# EAGLE schematic Rev_must_do_it,,,,,,,,,,, (EAGLE 9.3.0)

## Sheet 1 of 4
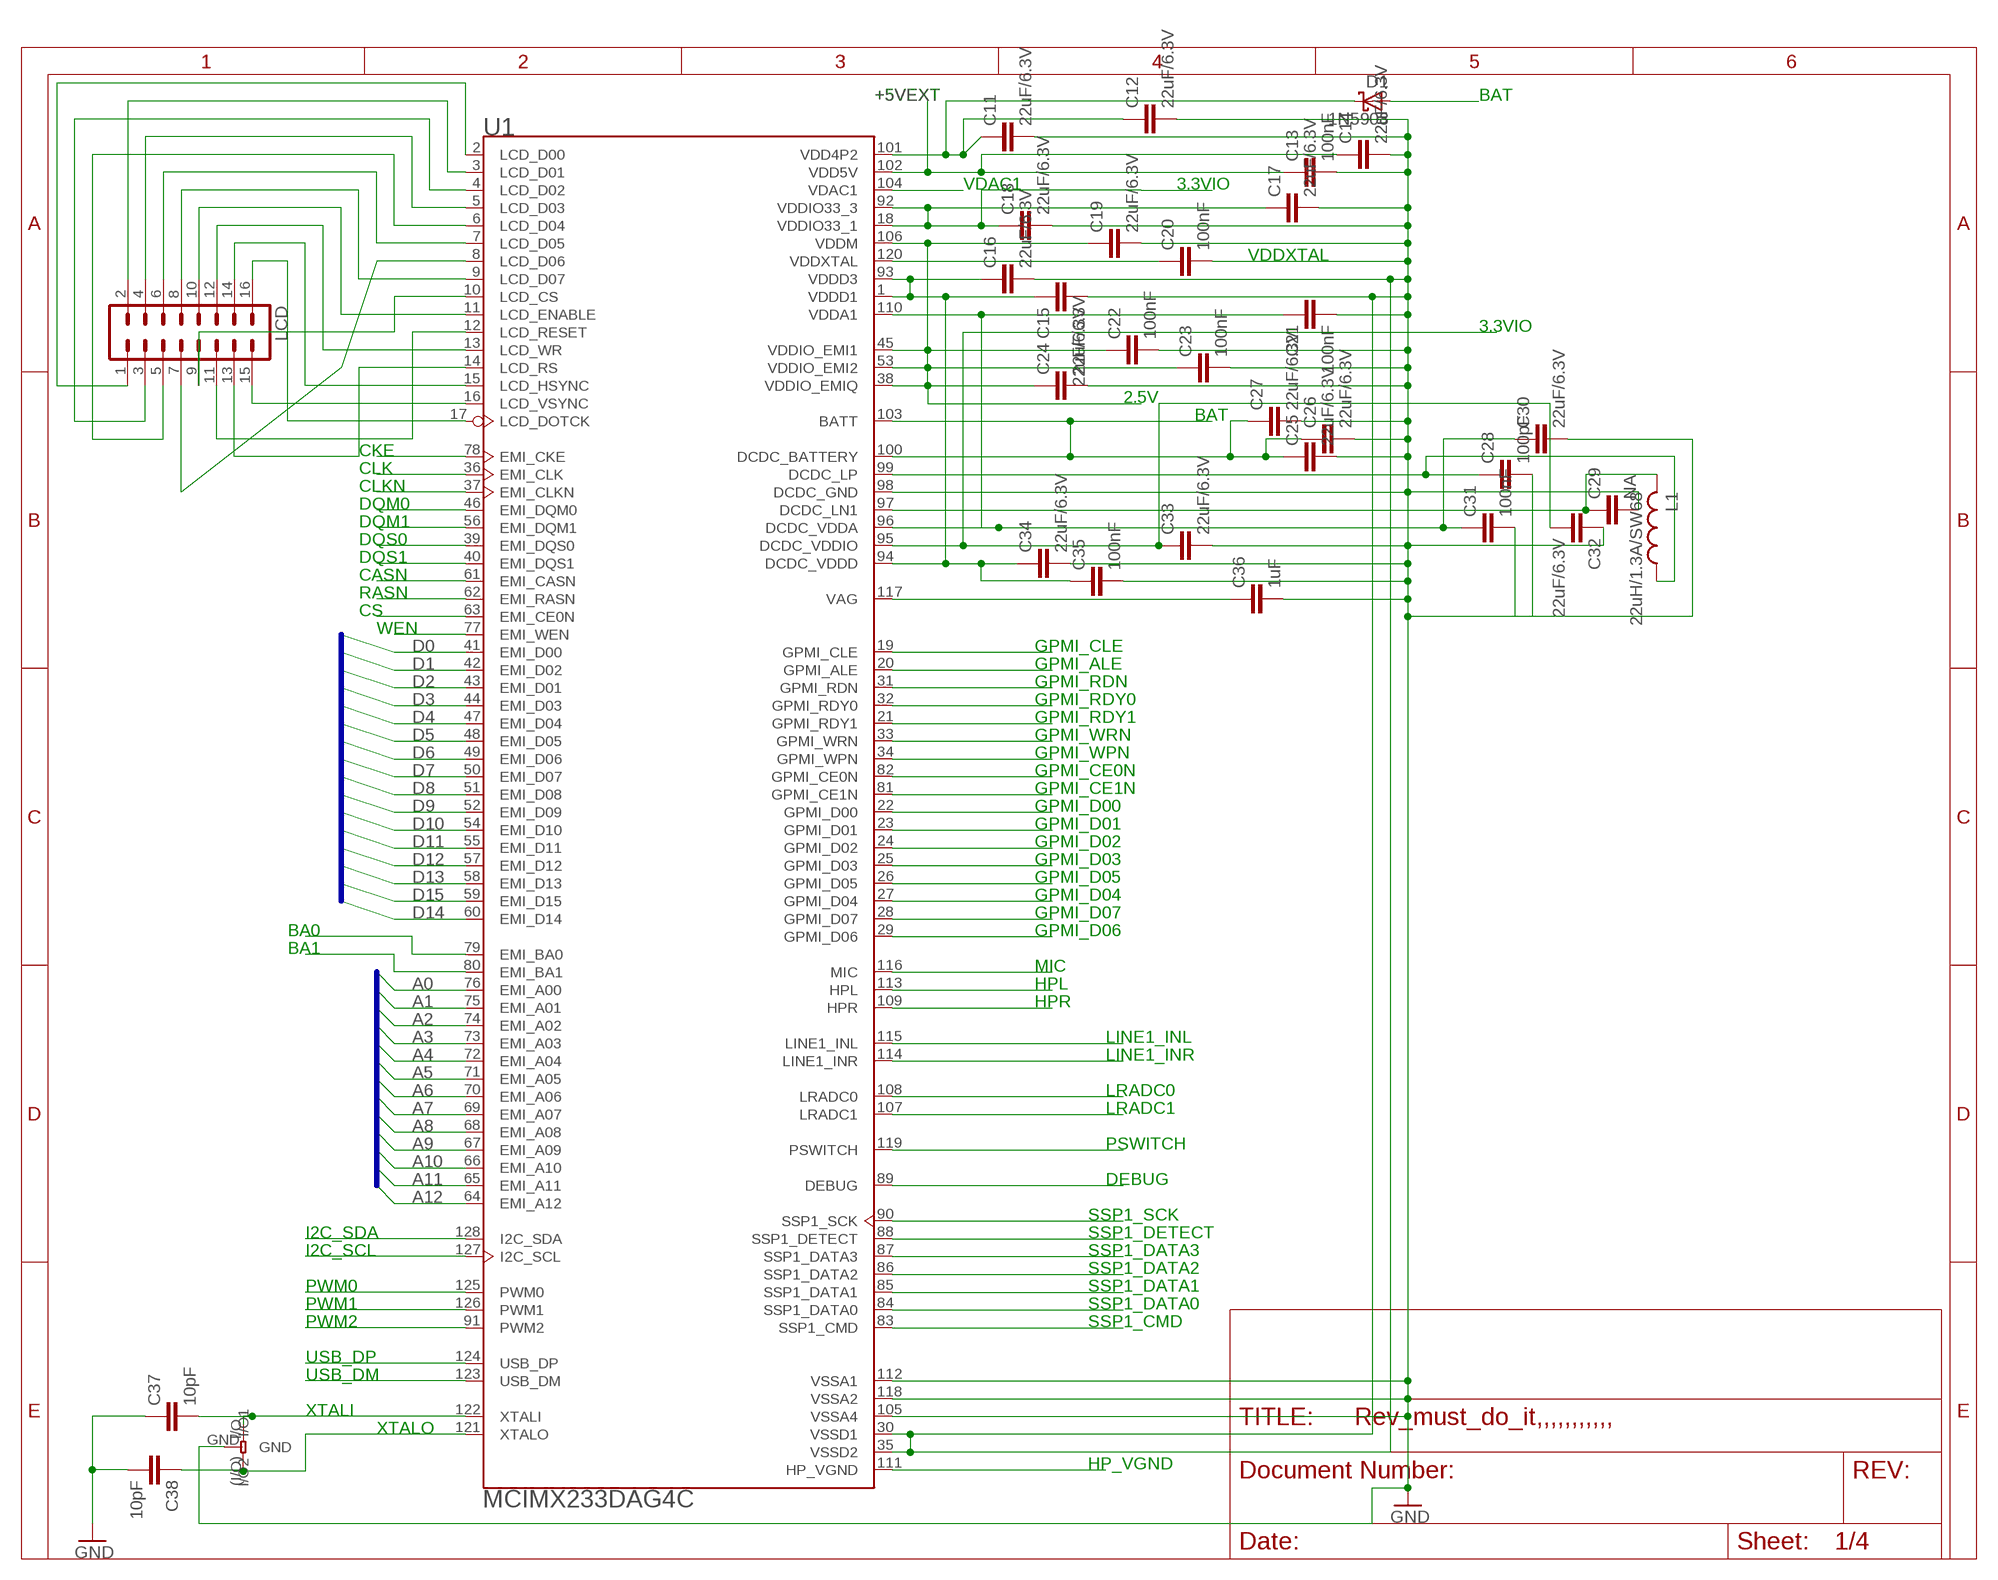
[diagram p0: schematic, sheet 1]

### Parts
C11  22uF/6.3V  C-EUC1206  [C1206]
C12  22uF/6.3V  C-EUC1206  [C1206]
C13  100nF  C-EUC1206  [C1206]
C14  22uF/6.3V  C-EUC1206  [C1206]
C15  22uF/6.3V  C-EUC1206  [C1206]
C16  22uF/6.3V  C-EUC1206  [C1206]
C17  22uF/6.3V  C-EUC1206  [C1206]
C18  22uF/6.3V  C-EUC1206  [C1206]
C19  22uF/6.3V  C-EUC1206  [C1206]
C20  100nF  C-EUC1206  [C1206]
C21  100nF  C-EUC1206  [C1206]
C22  100nF  C-EUC1206  [C1206]
C23  100nF  C-EUC1206  [C1206]
C24  22uF/6.3V  C-EUC1206  [C1206]
C25  22uF/6.3V  C-EUC1206  [C1206]
C26  22uF/6.3V  C-EUC1206  [C1206]
C27  22uF/6.3V  C-EUC1206  [C1206]
C28  100pF  C-EUC1206  [C1206]
C29  NA  C-EUC1206  [C1206]
C30  22uF/6.3V  C-EUC1206  [C1206]
C31  100nF  C-EUC1206  [C1206]
C32  22uF/6.3V  C-EUC1206  [C1206]
C33  22uF/6.3V  C-EUC1206  [C1206]
C34  22uF/6.3V  C-EUC1206  [C1206]
C35  100nF  C-EUC1206  [C1206]
C36  1uF  C-EUC1206  [C1206]
C37  10pF  C-EUC1206  [C1206]
C38  10pF  C-EUC1206  [C1206]
D1  1N5908  [C4111-15]
L1  22uH/1.3A/SW68  L-USLAL02  [LAL02]
LCD  MA08-2  [MA08-2]
U1  MCIMX233DAG4C  [QFP40P1600X1600X160-128N]
U$2  CRYSTAL  [CRYSTAL]

### Nets
2.5V: C19.1 C22.1 C23.1 C24.1 U1.38(VDDIO_EMIQ) U1.45(VDDIO_EMI1) U1.53(VDDIO_EMI2) U1.106(VDDM) ; also sheet 2,3
3.3VIO: C17.1 C18.1 C32.2 C33.1 U1.18(VDDIO33_1) U1.92(VDDIO33_3) U1.95(DCDC_VDDIO) ; also sheet 4
+5VEXT: C13.1 C14.1 U1.102(VDD5V) ; also sheet 3,4
A0: U1.76(EMI_A00) ; also sheet 2
A1: U1.75(EMI_A01) ; also sheet 2
A2: U1.74(EMI_A02) ; also sheet 2
A3: U1.73(EMI_A03) ; also sheet 2
A4: U1.72(EMI_A04) ; also sheet 2
A5: U1.71(EMI_A05) ; also sheet 2
A6: U1.70(EMI_A06) ; also sheet 2
A7: U1.69(EMI_A07) ; also sheet 2
A8: U1.68(EMI_A08) ; also sheet 2
A9: U1.67(EMI_A09) ; also sheet 2
A10: U1.66(EMI_A10) ; also sheet 2
A11: U1.65(EMI_A11) ; also sheet 2
A12: U1.64(EMI_A12) ; also sheet 2
BA0: U1.79(EMI_BA0) ; also sheet 2
BA1: U1.80(EMI_BA1) ; also sheet 2
BAT: C25.1 C26.1 C27.1 D1.A U1.100(DCDC_BATTERY) U1.103(BATT)
CASN: U1.61(EMI_CASN) ; also sheet 2
CKE: U1.78(EMI_CKE) ; also sheet 2
CLK: U1.36(EMI_CLK) ; also sheet 2
CLKN: U1.37(EMI_CLKN) ; also sheet 2
CS: U1.63(EMI_CE0N) ; also sheet 2
D0: U1.41(EMI_D00) ; also sheet 2
D1: U1.42(EMI_D02) ; also sheet 2
D2: U1.43(EMI_D01) ; also sheet 2
D3: U1.44(EMI_D03) ; also sheet 2
D4: U1.47(EMI_D04) ; also sheet 2
D5: U1.48(EMI_D05) ; also sheet 2
D6: U1.49(EMI_D06) ; also sheet 2
D7: U1.50(EMI_D07) ; also sheet 2
D8: U1.51(EMI_D08) ; also sheet 2
D9: U1.52(EMI_D09) ; also sheet 2
D10: U1.54(EMI_D10) ; also sheet 2
D11: U1.55(EMI_D11) ; also sheet 2
D12: U1.57(EMI_D12) ; also sheet 2
D13: U1.58(EMI_D13) ; also sheet 2
D14: U1.60(EMI_D14) ; also sheet 2
D15: U1.59(EMI_D15) ; also sheet 2
DCDC_VDDA1: C21.1 C30.1 C31.1 U1.96(DCDC_VDDA) U1.110(VDDA1)
DCDC_VDDD: C15.1 C16.1 C34.1 C35.1 U1.1(VDDD1) U1.93(VDDD3) U1.94(DCDC_VDDD)
DEBUG: U1.89(DEBUG) ; also sheet 3
DQM0: U1.46(EMI_DQM0) ; also sheet 2
DQM1: U1.56(EMI_DQM1) ; also sheet 2
DQS0: U1.39(EMI_DQS0) ; also sheet 2
DQS1: U1.40(EMI_DQS1) ; also sheet 2
GND: C11.2 C12.2 C13.2 C14.2 C15.2 C16.2 C17.2 C18.2 C19.2 C20.2 C21.2 C22.2 C23.2 C24.2 C25.2 C26.2 C27.2 C28.2 C29.2 C30.2 C31.2 C32.1 C33.2 C34.2 C35.2 C36.2 C37.1 C38.2 U1.30(VSSD1) U1.35(VSSD2) U1.98(DCDC_GND) U1.105(VSSA4) U1.112(VSSA1) U1.118(VSSA2) U$2.GND ; also sheet 2,3,4
GPMI_ALE: U1.20(GPMI_ALE) ; also sheet 3
GPMI_CE0N: U1.82(GPMI_CE0N) ; also sheet 3
GPMI_CE1N: U1.81(GPMI_CE1N) ; also sheet 3
GPMI_CLE: U1.19(GPMI_CLE) ; also sheet 3
GPMI_D00: U1.22(GPMI_D00) ; also sheet 3
GPMI_D01: U1.23(GPMI_D01) ; also sheet 3
GPMI_D02: U1.24(GPMI_D02) ; also sheet 3
GPMI_D03: U1.25(GPMI_D03) ; also sheet 3
GPMI_D04: U1.27(GPMI_D04) ; also sheet 3
GPMI_D05: U1.26(GPMI_D05) ; also sheet 3
GPMI_D06: U1.29(GPMI_D06) ; also sheet 3
GPMI_D07: U1.28(GPMI_D07) ; also sheet 3
GPMI_RDN: U1.31(GPMI_RDN) ; also sheet 3
GPMI_RDY0: U1.32(GPMI_RDY0) ; also sheet 3
GPMI_RDY1: U1.21(GPMI_RDY1) ; also sheet 3
GPMI_WPN: U1.34(GPMI_WPN) ; also sheet 3
GPMI_WRN: U1.33(GPMI_WRN) ; also sheet 3
HP_VGND: U1.111(HP_VGND)
HPL: U1.113(HPL) ; also sheet 3
HPR: U1.109(HPR) ; also sheet 3
I2C_SCL: U1.127(I2C_SCL) ; also sheet 3
I2C_SDA: U1.128(I2C_SDA) ; also sheet 3
LINE1_INL: U1.115(LINE1_INL) ; also sheet 3
LINE1_INR: U1.114(LINE1_INR) ; also sheet 3
LRADC0: U1.108(LRADC0) ; also sheet 3
LRADC1: U1.107(LRADC1) ; also sheet 3
MIC: U1.116(MIC) ; also sheet 3
N$1: C36.1 U1.117(VAG)
N$6: C11.1 C12.1 D1.C U1.101(VDD4P2)
N$7: LCD.1 U1.2(LCD_D00)
N$10: C29.1 L1.2 U1.97(DCDC_LN1)
N$11: C28.1 L1.1 U1.99(DCDC_LP)
N$12: LCD.2 U1.3(LCD_D01)
N$13: LCD.3 U1.4(LCD_D02)
N$14: LCD.4 U1.5(LCD_D03)
N$15: LCD.5 U1.6(LCD_D04)
N$16: LCD.6 U1.7(LCD_D05)
N$17: LCD.7 U1.8(LCD_D06)
N$20: LCD.8 U1.9(LCD_D07)
N$21: LCD.9 U1.10(LCD_CS)
N$22: LCD.10 U1.11(LCD_ENABLE)
N$23: LCD.11 U1.12(LCD_RESET)
N$24: LCD.12 U1.13(LCD_WR)
N$25: LCD.13 U1.14(LCD_RS)
N$26: LCD.14 U1.15(LCD_HSYNC)
N$27: LCD.15 U1.16(LCD_VSYNC)
N$28: LCD.16 U1.17(LCD_DOTCK)
PSWITCH: U1.119(PSWITCH) ; also sheet 3,4
PWM0: U1.125(PWM0) ; also sheet 3
PWM1: U1.126(PWM1) ; also sheet 3
PWM2: U1.91(PWM2) ; also sheet 3
RASN: U1.62(EMI_RASN) ; also sheet 2
SSP1_CMD: U1.83(SSP1_CMD) ; also sheet 3,4
SSP1_DATA0: U1.84(SSP1_DATA0) ; also sheet 3,4
SSP1_DATA1: U1.85(SSP1_DATA1) ; also sheet 3,4
SSP1_DATA2: U1.86(SSP1_DATA2) ; also sheet 3
SSP1_DATA3: U1.87(SSP1_DATA3) ; also sheet 3,4
SSP1_DETECT: U1.88(SSP1_DETECT) ; also sheet 4
SSP1_SCK: U1.90(SSP1_SCK) ; also sheet 3,4
USB_DM: U1.123(USB_DM) ; also sheet 4
USB_DP: U1.124(USB_DP) ; also sheet 4
VDAC1: U1.104(VDAC1)
VDDXTAL: C20.1 U1.120(VDDXTAL) ; also sheet 4
WEN: U1.77(EMI_WEN) ; also sheet 2
XTALI: C37.2 U1.122(XTALI) U$2.I/O(I/O2) ; also sheet 4
XTALO: C38.1 U1.121(XTALO) U$2.(I/O)(I/O1) ; also sheet 4

### Buses
ADDR:A[0..12]
DATA:D[0..15]

## Sheet 2 of 4
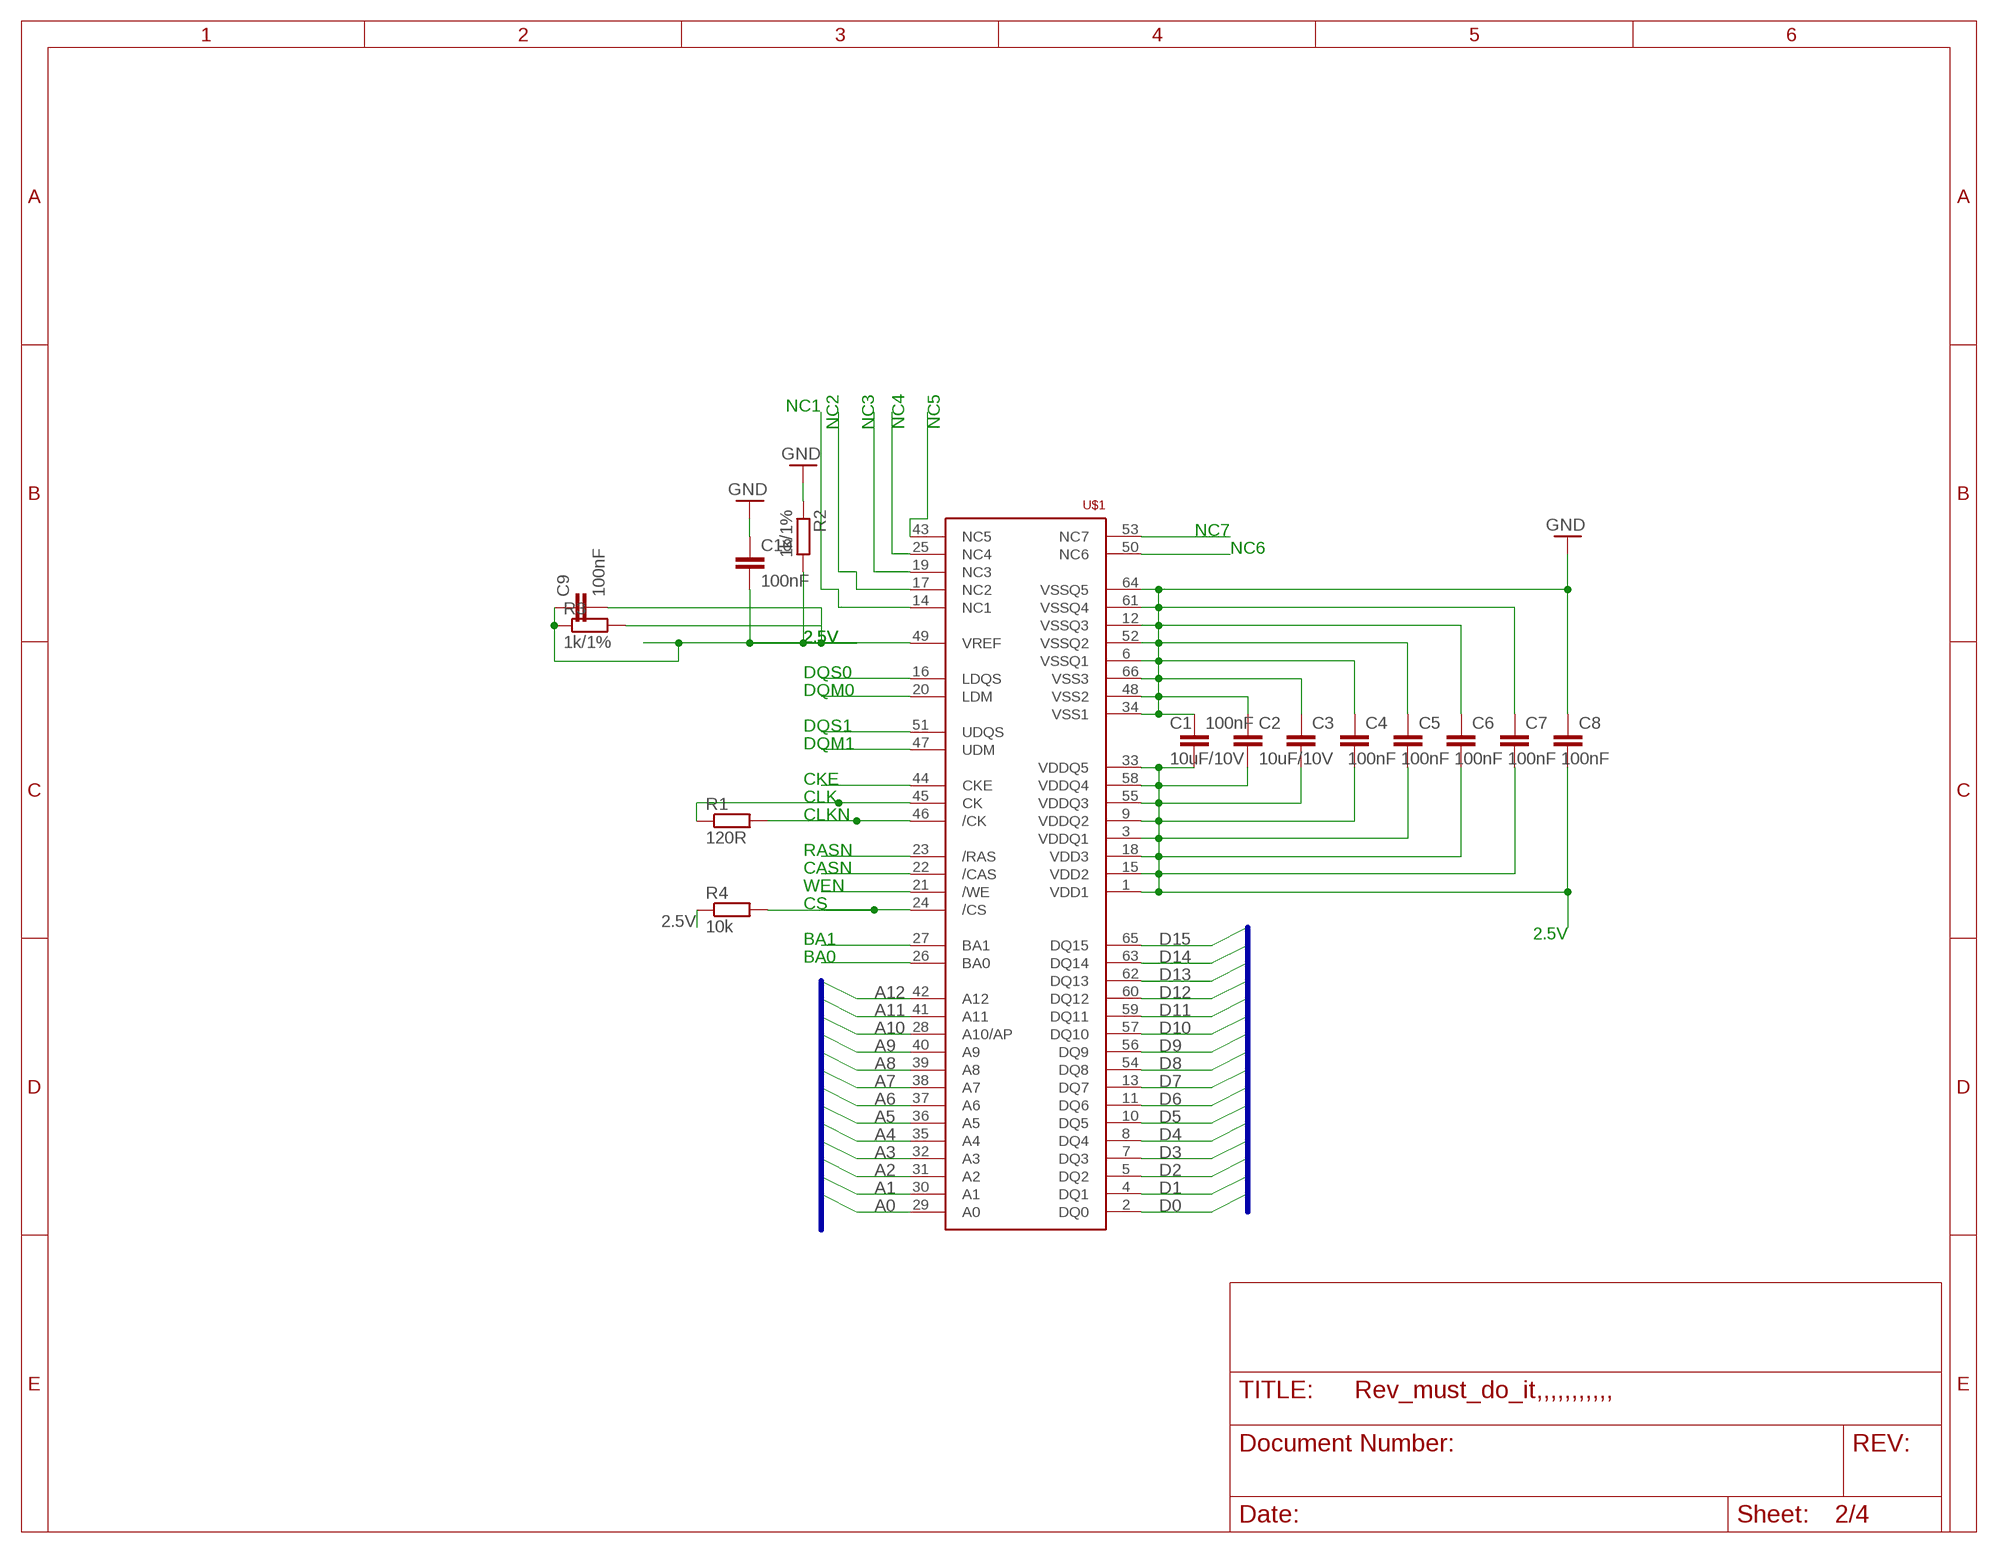
[diagram p1: schematic, sheet 2]

### Parts
C1  10uF/10V  C-EUC1206  [C1206]
C2  100nF  C-EUC1206  [C1206]
C3  10uF/10V  C-EUC1206  [C1206]
C4  100nF  C-EUC1206  [C1206]
C5  100nF  C-EUC1206  [C1206]
C6  100nF  C-EUC1206  [C1206]
C7  100nF  C-EUC1206  [C1206]
C8  100nF  C-EUC1206  [C1206]
C9  100nF  C-EUC1206  [C1206]
C10  100nF  C-EUC1206  [C1206]
R1  120R  R-EU_R1206  [R1206]
R2  1k/1%  R-EU_R1206  [R1206]
R3  1k/1%  R-EU_R1206  [R1206]
R4  10k  R-EU_R1206  [R1206]
U$1  HY5DU121622D(L)T(P)-JTSOP-II  [TSOP66]

### Nets
2.5V: C1.2 C2.2 C3.2 C4.2 C5.2 C6.2 C7.2 C8.2 C9.1 C9.2 C10.2 R2.2 R3.1 R4.1 U$1.1(VDD1) U$1.3(VDDQ1) U$1.9(VDDQ2) U$1.15(VDD2) U$1.18(VDD3) U$1.33(VDDQ5) U$1.49(VREF) U$1.55(VDDQ3) U$1.58(VDDQ4) ; also sheet 1,3
A0: U$1.29(A0) ; also sheet 1
A1: U$1.30(A1) ; also sheet 1
A2: U$1.31(A2) ; also sheet 1
A3: U$1.32(A3) ; also sheet 1
A4: U$1.35(A4) ; also sheet 1
A5: U$1.36(A5) ; also sheet 1
A6: U$1.37(A6) ; also sheet 1
A7: U$1.38(A7) ; also sheet 1
A8: U$1.39(A8) ; also sheet 1
A9: U$1.40(A9) U$1.63(DQ14) ; also sheet 1
A10: U$1.28(A10/AP) ; also sheet 1
A11: U$1.41(A11) ; also sheet 1
A12: U$1.42(A12) ; also sheet 1
BA0: U$1.26(BA0) ; also sheet 1
BA1: U$1.27(BA1) ; also sheet 1
CASN: U$1.22(/CAS) ; also sheet 1
CKE: U$1.44(CKE) ; also sheet 1
CLK: R1.1 U$1.45(CK) ; also sheet 1
CLKN: R1.2 U$1.46(/CK) ; also sheet 1
CS: R4.2 U$1.24(/CS) ; also sheet 1
D0: U$1.2(DQ0) ; also sheet 1
D1: U$1.4(DQ1) ; also sheet 1
D2: U$1.5(DQ2) ; also sheet 1
D3: U$1.7(DQ3) ; also sheet 1
D4: U$1.8(DQ4) ; also sheet 1
D5: U$1.10(DQ5) ; also sheet 1
D6: U$1.11(DQ6) ; also sheet 1
D7: U$1.13(DQ7) ; also sheet 1
D8: U$1.54(DQ8) ; also sheet 1
D9: U$1.56(DQ9) ; also sheet 1
D10: U$1.57(DQ10) ; also sheet 1
D11: U$1.59(DQ11) ; also sheet 1
D12: U$1.60(DQ12) ; also sheet 1
D13: U$1.62(DQ13) ; also sheet 1
D15: U$1.65(DQ15) ; also sheet 1
DQM0: U$1.20(LDM) ; also sheet 1
DQM1: U$1.47(UDM) ; also sheet 1
DQS0: U$1.16(LDQS) ; also sheet 1
DQS1: U$1.51(UDQS) ; also sheet 1
GND: C1.1 C2.1 C3.1 C4.1 C5.1 C6.1 C7.1 C8.1 C10.1 R2.1 U$1.6(VSSQ1) U$1.12(VSSQ3) U$1.34(VSS1) U$1.48(VSS2) U$1.52(VSSQ2) U$1.61(VSSQ4) U$1.64(VSSQ5) U$1.66(VSS3) ; also sheet 1,3,4
N$29: R3.2
NC1: U$1.14(NC1) ; also sheet 3
NC2: U$1.17(NC2) ; also sheet 3
NC3: U$1.19(NC3) ; also sheet 3
NC4: U$1.25(NC4) ; also sheet 3
NC5: U$1.43(NC5) ; also sheet 3
NC6: U$1.50(NC6) ; also sheet 3
NC7: U$1.53(NC7) ; also sheet 3
RASN: U$1.23(/RAS) ; also sheet 1
WEN: U$1.21(/WE) ; also sheet 1

### Buses
ADDR:A0,A1,A2,A3,A4,A5,A6,A7,A8,A9,A10,A11,A12
DATA:D0,D1,D2,D3,D4,D5,D6,D7,D8,D9,D10,D11,D12,D13,D14,D15

## Sheet 3 of 4
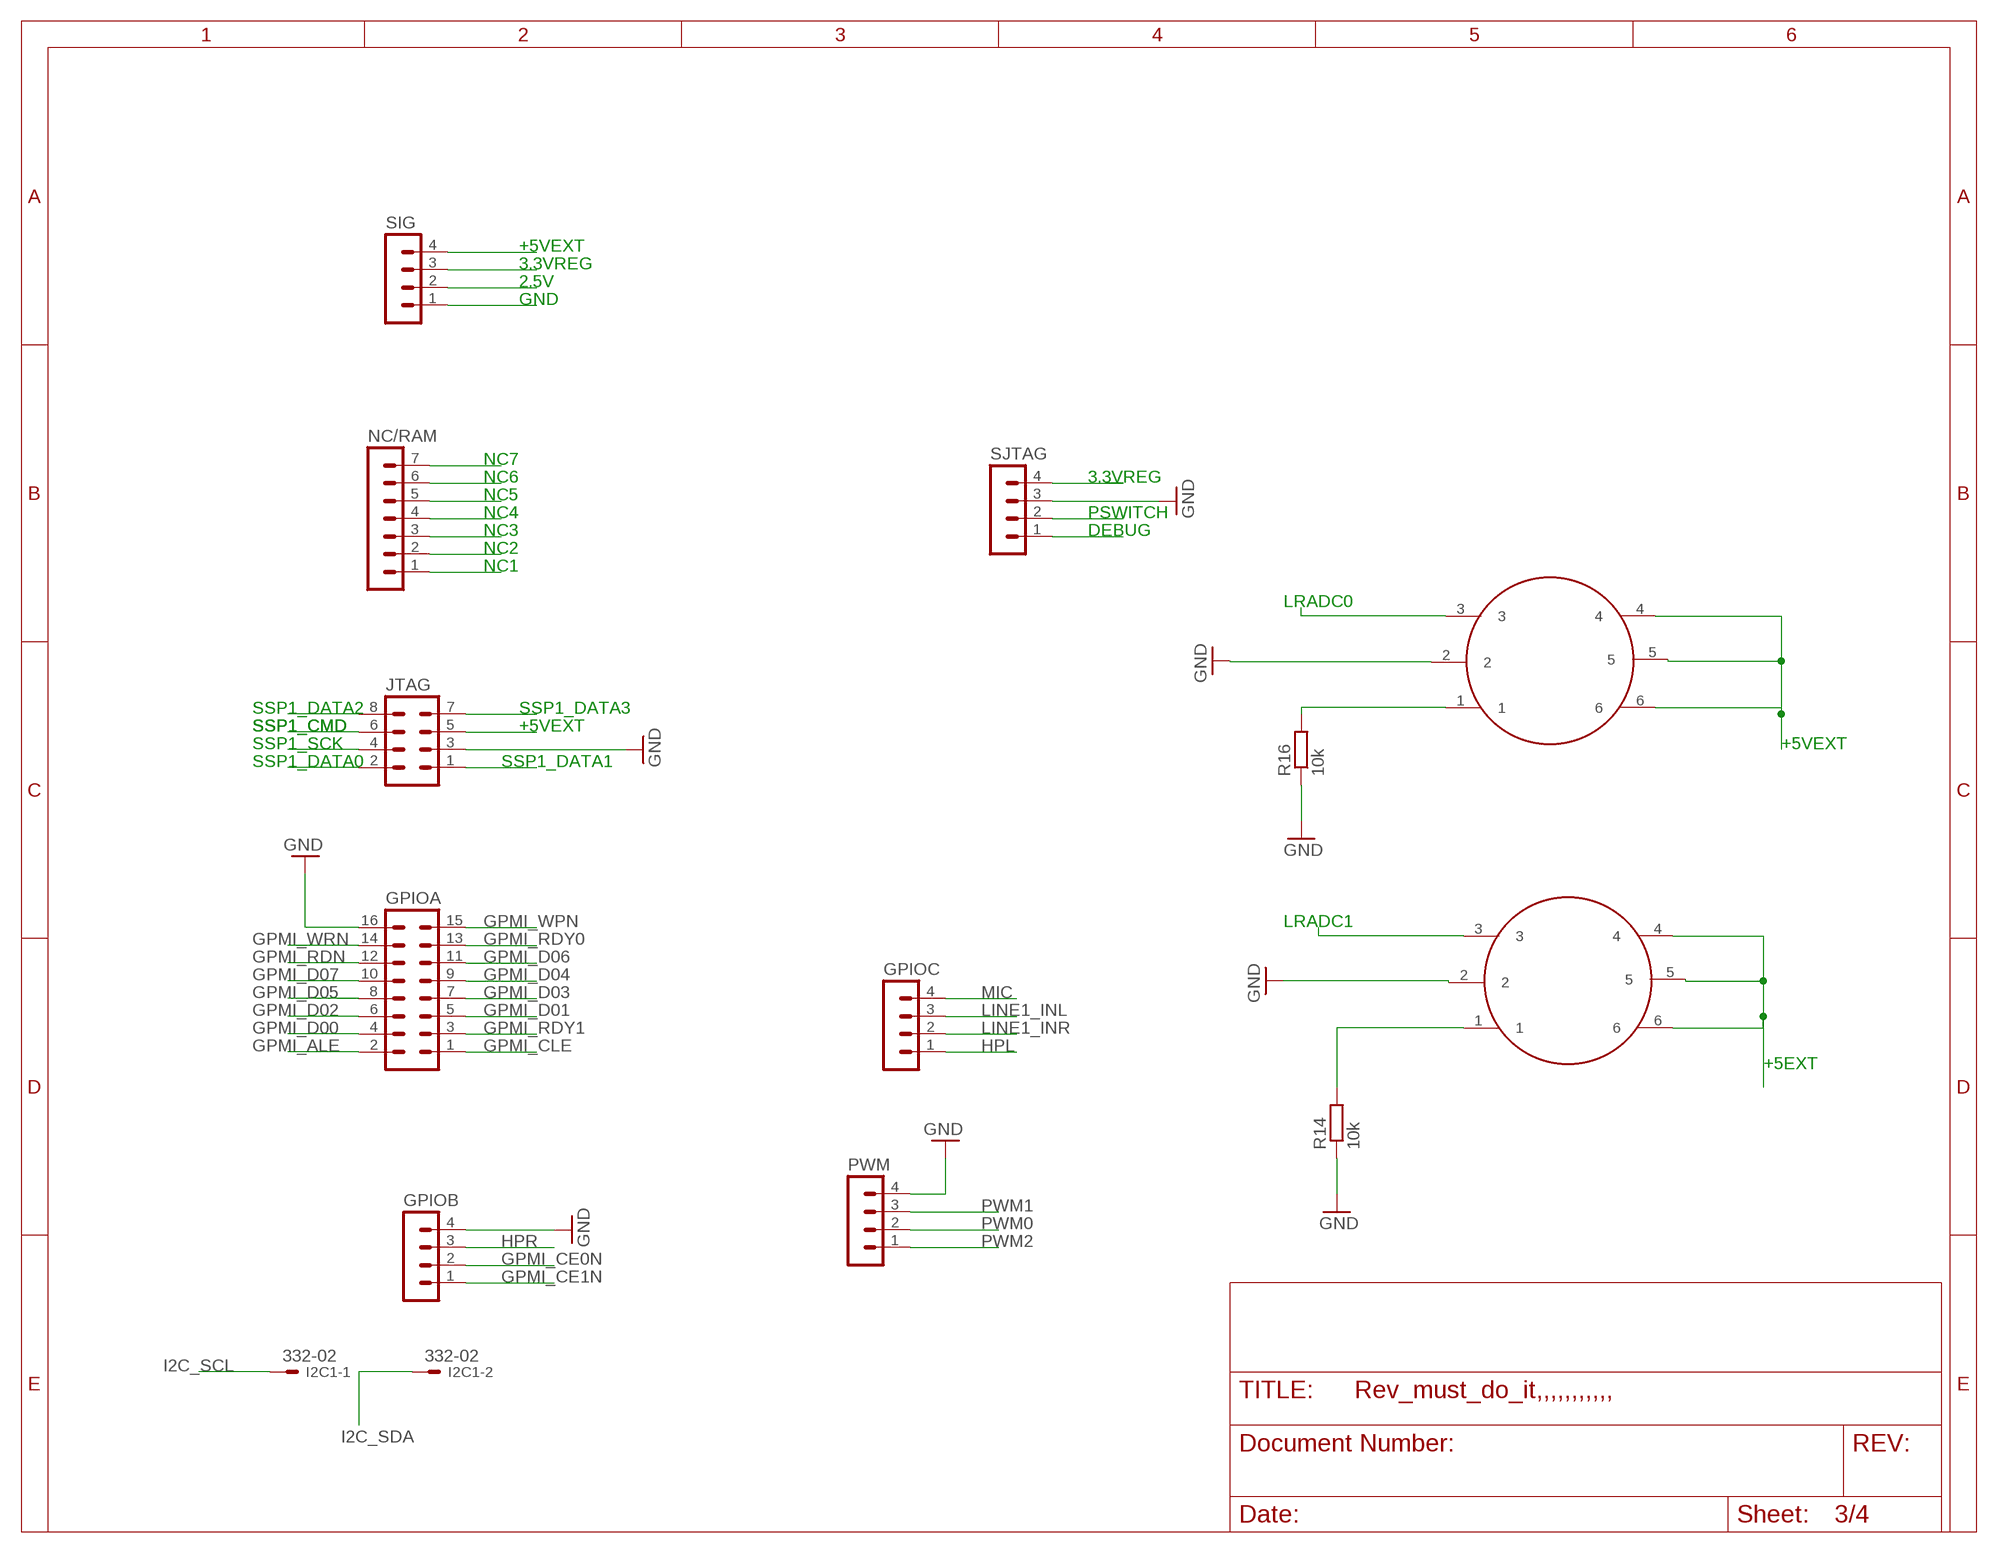
[diagram p2: schematic, sheet 3]

### Parts
GPIOA  MA08-2  [MA08-2]
GPIOB  MA04-1  [MA04-1]
GPIOC  MA04-1  [MA04-1]
I2C1  332-02  [332-02]
JTAG  MA04-2  [MA04-2]
NC/RAM  MA07-1  [MA07-1]
PWM  MA04-1  [MA04-1]
R14  10k  R-EU_R1206  [R1206]
R16  10k  R-EU_R1206  [R1206]
SIG  MA04-1  [MA04-1]
SJTAG  MA04-1  [MA04-1]
U$5  SENSOR  [SENSOR]
U$6  SENSOR  [SENSOR]

### Nets
2.5V: SIG.2 ; also sheet 1,2
3.3VREG: SIG.3 SJTAG.4 ; also sheet 4
+5EXT: U$6.4 U$6.5 U$6.6
+5VEXT: JTAG.5 SIG.4 U$5.4 U$5.5 U$5.6 ; also sheet 1,4
DEBUG: SJTAG.1 ; also sheet 1
GND: GPIOA.16 GPIOB.4 JTAG.3 PWM.4 R14.1 R16.1 SIG.1 SJTAG.3 U$5.2 U$6.2 ; also sheet 1,2,4
GPMI_ALE: GPIOA.2 ; also sheet 1
GPMI_CE0N: GPIOB.2 ; also sheet 1
GPMI_CE1N: GPIOB.1 ; also sheet 1
GPMI_CLE: GPIOA.1 ; also sheet 1
GPMI_D00: GPIOA.4 ; also sheet 1
GPMI_D01: GPIOA.5 ; also sheet 1
GPMI_D02: GPIOA.6 ; also sheet 1
GPMI_D03: GPIOA.7 ; also sheet 1
GPMI_D04: GPIOA.9 ; also sheet 1
GPMI_D05: GPIOA.8 ; also sheet 1
GPMI_D06: GPIOA.11 ; also sheet 1
GPMI_D07: GPIOA.10 ; also sheet 1
GPMI_RDN: GPIOA.12 ; also sheet 1
GPMI_RDY0: GPIOA.13 ; also sheet 1
GPMI_RDY1: GPIOA.3 ; also sheet 1
GPMI_WPN: GPIOA.15 ; also sheet 1
GPMI_WRN: GPIOA.14 ; also sheet 1
HPL: GPIOC.1 ; also sheet 1
HPR: GPIOB.3 ; also sheet 1
I2C_SCL: I2C1.1 ; also sheet 1
I2C_SDA: I2C1.2 ; also sheet 1
LINE1_INL: GPIOC.3 ; also sheet 1
LINE1_INR: GPIOC.2 ; also sheet 1
LRADC0: U$5.3 ; also sheet 1
LRADC1: U$6.3 ; also sheet 1
MIC: GPIOC.4 ; also sheet 1
N$19: R16.2 U$5.1
N$34: R14.2 U$6.1
NC1: NC/RAM.1 ; also sheet 2
NC2: NC/RAM.2 ; also sheet 2
NC3: NC/RAM.3 ; also sheet 2
NC4: NC/RAM.4 ; also sheet 2
NC5: NC/RAM.5 ; also sheet 2
NC6: NC/RAM.6 ; also sheet 2
NC7: NC/RAM.7 ; also sheet 2
PSWITCH: SJTAG.2 ; also sheet 1,4
PWM0: PWM.2 ; also sheet 1
PWM1: PWM.3 ; also sheet 1
PWM2: PWM.1 ; also sheet 1
SSP1_CMD: JTAG.6 ; also sheet 1,4
SSP1_DATA0: JTAG.2 ; also sheet 1,4
SSP1_DATA1: JTAG.1 ; also sheet 1,4
SSP1_DATA2: JTAG.8 ; also sheet 1
SSP1_DATA3: JTAG.7 ; also sheet 1,4
SSP1_SCK: JTAG.4 ; also sheet 1,4

## Sheet 4 of 4
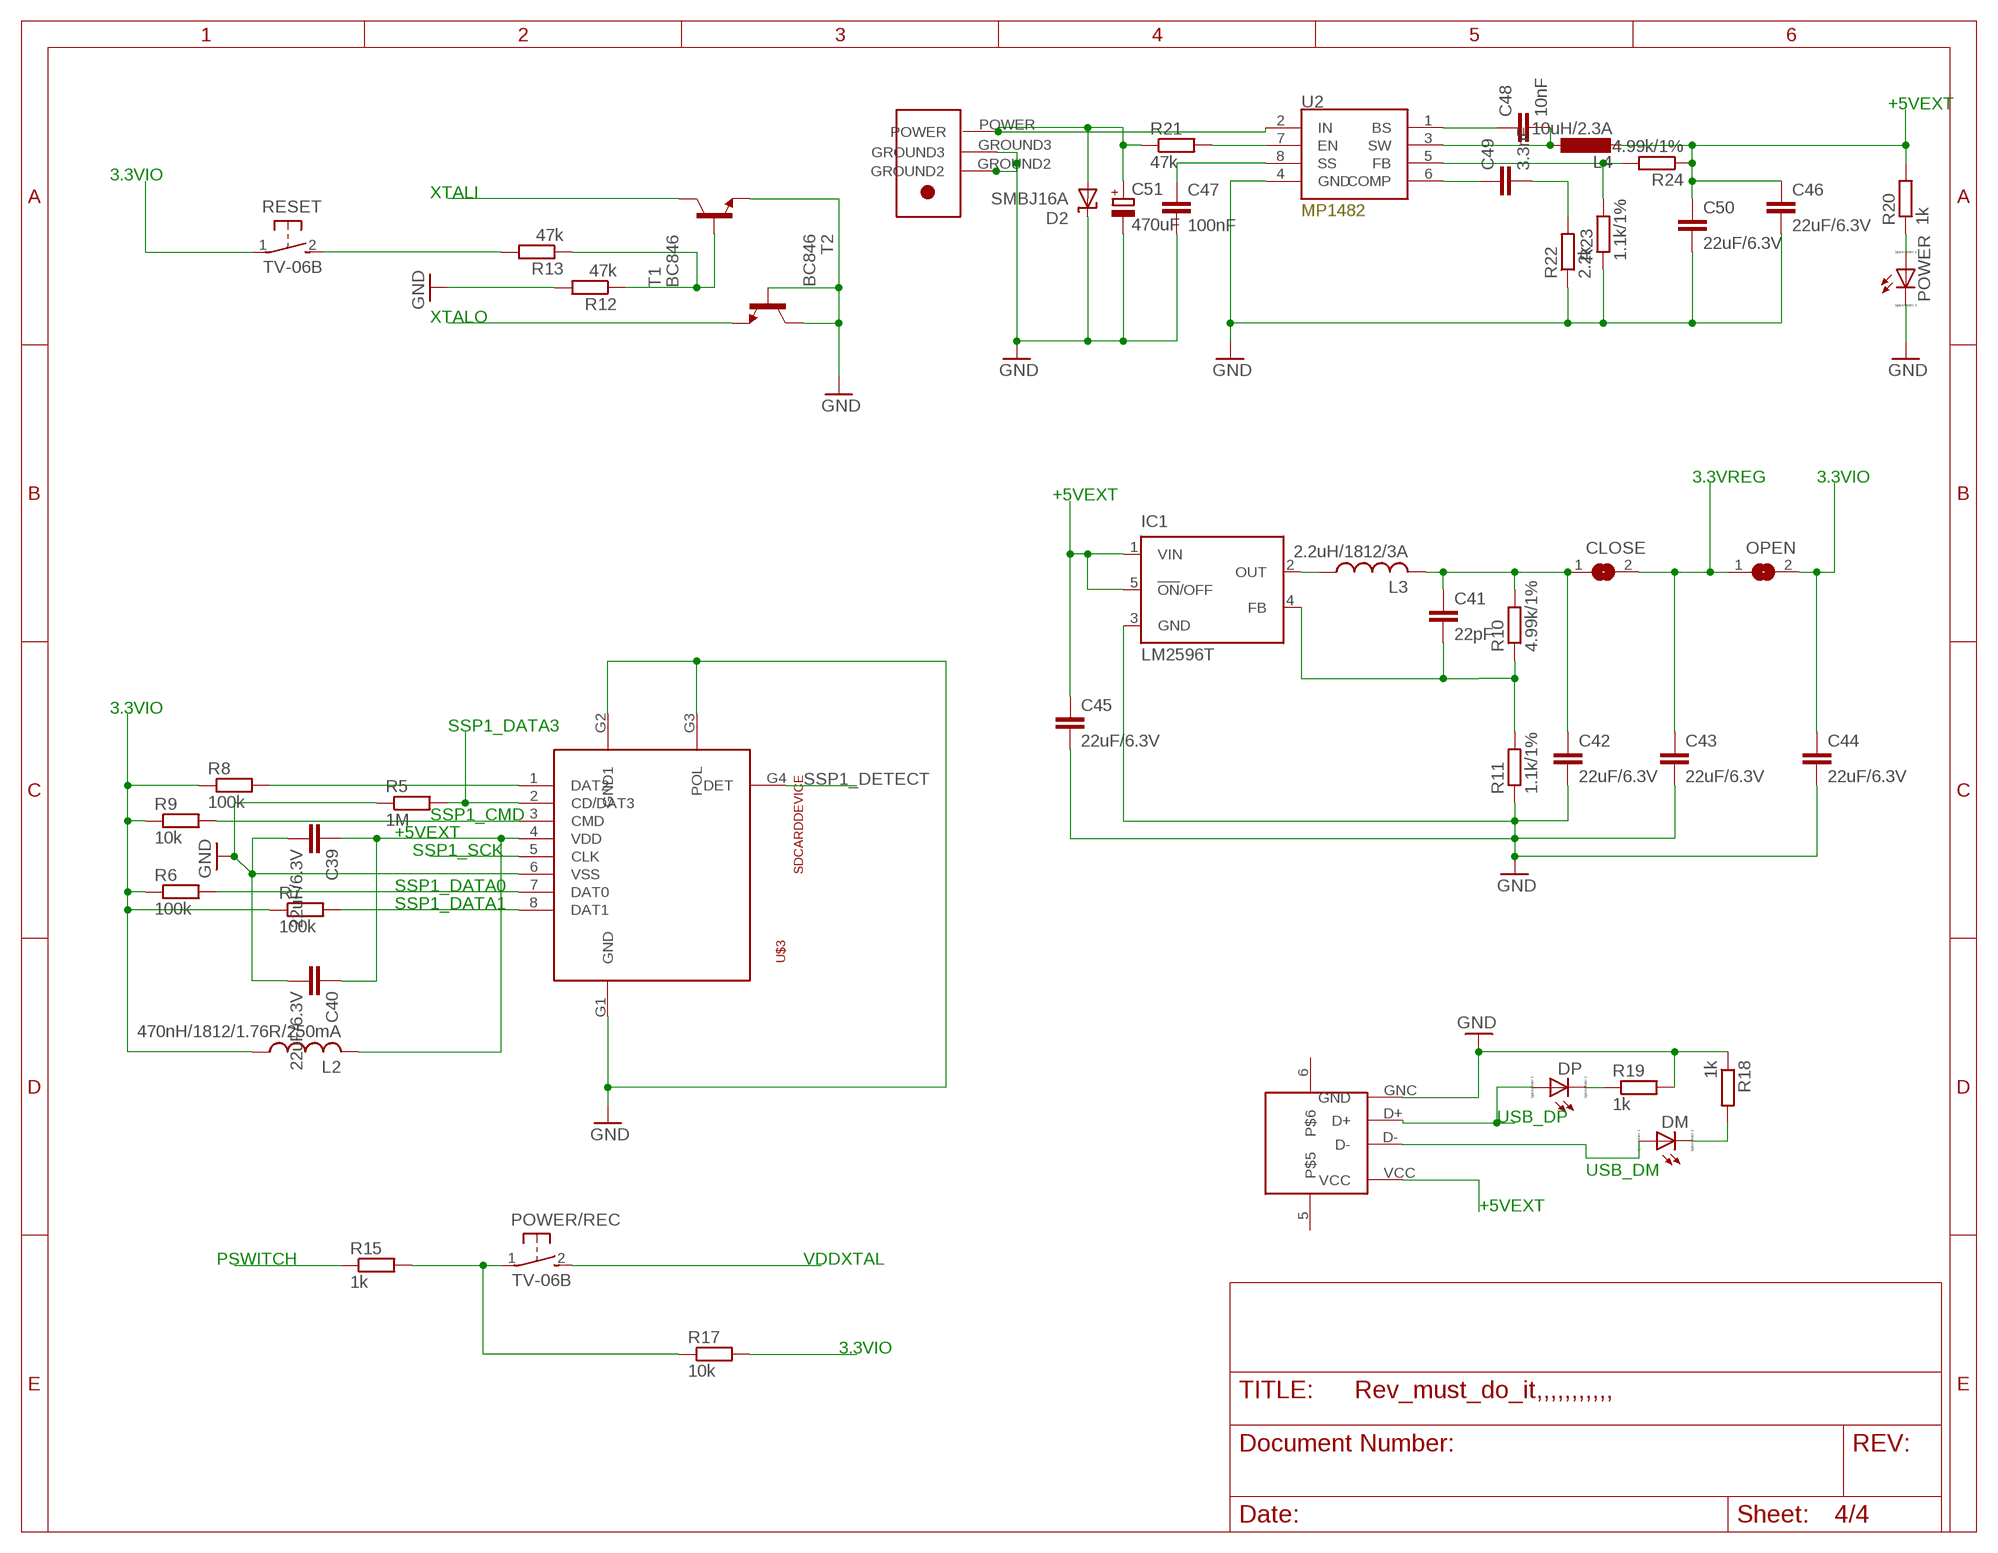
[diagram p3: schematic, sheet 4]

### Parts
C39  22uF/6.3V  C-EUC1206  [C1206]
C40  22uF/6.3V  C-EUC1206  [C1206]
C41  22pF  C-EUC1206  [C1206]
C42  22uF/6.3V  C-EUC1206  [C1206]
C43  22uF/6.3V  C-EUC1206  [C1206]
C44  22uF/6.3V  C-EUC1206  [C1206]
C45  22uF/6.3V  C-EUC1206  [C1206]
C46  22uF/6.3V  C-EUC1206  [C1206]
C47  100nF  C-EUC1206  [C1206]
C48  10nF  C-EUC1206  [C1206]
C49  3.3nF  C-EUC1206  [C1206]
C50  22uF/6.3V  C-EUC1206  [C1206]
C51  470uF  CPOL-EU085CS-1AR  [085CS_1AR]
CLOSE  SJ  [SJ]
D2  SMBJ16A  SUPPRESSOR-SMBJ  [SMBJ]
DM  LED_E  [LED_1206]
DP  LED_E  [LED_1206]
IC1  LM2596T  [T05D]
L2  470nH/1812/1.76R/250mA  L-USL1812  [L1812]
L3  2.2uH/1812/3A  L-USL1812  [L1812]
L4  10uH/2.3A  L-EUL1812  [L1812]
OPEN  SJ  [SJ]
POWER  LED_E  [LED_1206]
POWER/REC  TV-06B  31-XX  [B3F-31XX]
R5  1M  R-EU_M1206  [M1206]
R6  100k  R-EU_M1206  [M1206]
R7  100k  R-EU_M1206  [M1206]
R8  100k  R-EU_M1206  [M1206]
R9  10k  R-EU_M1206  [M1206]
R10  4.99k/1%  R-EU_R1206  [R1206]
R11  1.1k/1%  R-EU_R1206  [R1206]
R12  47k  R-EU_R1206  [R1206]
R13  47k  R-EU_R1206  [R1206]
R15  1k  R-EU_M1206  [M1206]
R17  10k  R-EU_M1206  [M1206]
R18  1k  R-EU_R1206  [R1206]
R19  1k  R-EU_R1206  [R1206]
R20  1k  R-EU_R1206  [R1206]
R21  47k  R-EU_M0805  [M0805]
R22  2.2k  R-EU_M0805  [M0805]
R23  1.1k/1%  R-EU_M0805  [M0805]
R24  4.99k/1%  R-EU_M0805  [M0805]
RESET  TV-06B  31-XX  [B3F-31XX]
T1  BC846  [SOT23]
T2  BC846  [SOT23]
U2  MP1482  [SOIC8]
U$3  SDCARDDEVICE  [SDCARD]
U$4  USB2.0  [USB2.0]
U$7  DC_POWER  [DC_POWER]

### Nets
3.3VIO: C44.1 L2.1 OPEN.2 R6.1 R7.1 R8.1 R9.1 R17.2 RESET.1(P) ; also sheet 1
3.3VREG: C43.1 CLOSE.2 OPEN.1 ; also sheet 3
+5VEXT: C39.1 C40.1 C45.1 C46.1 C50.1 IC1.1(VIN) IC1.5(!ON!/OFF) L2.2 L4.2 R20.2 R24.1 U$3.4(VDD) U$4.VCC ; also sheet 1,3
GND: C39.2 C40.2 C42.2 C43.2 C44.2 C45.2 C46.2 C47.2 C50.2 C51.- D2.C IC1.3(GND) POWER.C R5.1 R11.1 R12.2 R18.1 R19.2 R22.1 R23.1 T1.2(E) T2.1(B) T2.3(C) U2.4(GND) U$3.6(VSS) U$3.G1(GND) U$3.G2(GND1) U$3.G3(POL) U$4.GNC(GND) U$7.GROUND2 U$7.GROUND3 ; also sheet 1,2,3
N$2: IC1.2(OUT) L3.1
N$3: C41.1 C42.1 CLOSE.1 L3.2 R10.2
N$4: DP.C R19.1
N$5: C51.+ D2.A R21.1 U2.2(IN) U$7.POWER
N$8: C41.2 IC1.4(FB) R10.1 R11.2
N$9: R8.2 U$3.1(DAT2)
N$18: POWER/REC.1(P) R15.2 R17.1
N$30: R12.1 R13.1 T1.1(B)
N$31: R13.2 RESET.2(S)
N$32: DM.C R18.2
N$33: R21.2 U2.7(EN)
N$35: POWER.A R20.1
N$40: C47.1 U2.8(SS)
N$41: C48.1 U2.1(BS)
N$42: C48.2 L4.1 U2.3(SW)
N$44: C49.1 U2.6(COMP)
N$45: C49.2 R22.2
N$46: R23.2 R24.2 U2.5(FB)
PSWITCH: R15.1 ; also sheet 1,3
SSP1_CMD: R9.2 U$3.3(CMD) ; also sheet 1,3
SSP1_DATA0: R6.2 U$3.7(DAT0) ; also sheet 1,3
SSP1_DATA1: R7.2 U$3.8(DAT1) ; also sheet 1,3
SSP1_DATA3: R5.2 U$3.2(CD/DAT3) ; also sheet 1,3
SSP1_DETECT: U$3.G4(DET) ; also sheet 1
SSP1_SCK: U$3.5(CLK) ; also sheet 1,3
USB_DM: DM.A U$4.D- ; also sheet 1
USB_DP: DP.A U$4.D+ ; also sheet 1
VDDXTAL: POWER/REC.2(S) ; also sheet 1
XTALI: T1.3(C) ; also sheet 1
XTALO: T2.2(E) ; also sheet 1
Unconnected: U$4.5 U$4.6

## Library data of the parts
C1-C50 = rcl:C-EU: CAPACITOR, European symbol; SPICEPREFIX: C
C51 = rcl:CPOL-EU: POLARIZED CAPACITOR, European symbol; SPICEPREFIX: C
CLOSE OPEN = jumper:SJ: SMD solder JUMPER
D1 = diode:1N5908: DIODE schottky
D2 = diode:SUPPRESSOR-: Suppressor diode
DM DP POWER = eagle-ltspice:LED_E: LED Source: http://www.osram.convergy.de Source: www.luxeon.com Source: www.kingbright.com; SPICEMODEL: NONE; SPICEPREFIX: D; SPICETYPE: diode
GPIOA LCD = con-lstb:MA08-2: PIN HEADER; OC_FARNELL: unknown; OC_NEWARK: unknown
GPIOB GPIOC PWM SIG SJTAG = con-lstb:MA04-1: PIN HEADER; OC_FARNELL: unknown; OC_NEWARK: unknown
I2C1 = con-garry:332-02: 2 Pin - 2mm Dual Row Source: www.mpe-connector.de / garry_shortform_2012.pdf
IC1 = national-semiconductor:LM2596: SIMPLE SWITCHER® Power Converter 150 kHz 3A Step-Down Voltage Regulator Source: http://www.national.com/ds/LM/LM2596.pdf; MPN: LM2596T-ADJ/LF02; OC_FARNELL: 9494162; OC_NEWARK: 65K5910
JTAG = con-lstb:MA04-2: PIN HEADER; OC_FARNELL: unknown; OC_NEWARK: unknown
L1-L3 = rcl:L-US: INDUCTOR, American symbol; SPICEPREFIX: L
L4 = rcl:L-EU: INDUCTOR, European symbol; SPICEPREFIX: L
NC/RAM = con-lstb:MA07-1: PIN HEADER; OC_FARNELL: unknown; OC_NEWARK: unknown
POWER/REC RESET = switch-omron:31-XX: OMRON SWITCH
R1-R24 = rcl:R-EU_: RESISTOR, European symbol; SPICEPREFIX: R
T1 T2 = transistor:BC846: NPN TRANSISTOR
U1 = MCIMX233DAG4C:MCIMX233DAG4C: Mpu, 32bit, 454mhz, Lqfp-128; DESCRIPTION: Mpu, 32bit, 454mhz, Lqfp-128; DIGI-KEY_PART_NUMBER: MCIMX233DAG4C-ND; DIGI-KEY_PURCHASE_URL: https://www.digikey.com/product-detail/en/nxp-usa-inc/MCIMX233DAG4C/MCIMX233DAG4C-ND/2660586?utm_source=snapeda&utm_medium=aggregator&utm_campaign=symbol; MF: NXP Semiconductors; MP: MCIMX233DAG4C; PACKAGE: LQFP-128 NXP Semiconductors
U2 = MP1482:MP1482; AVAILABILITY: Unavailable; DESCRIPTION: 2a/18v Synchronous Rectified Step-Down; MF: MPS; MP: MP1482; PACKAGE: None; PRICE: None
U$1 = 7eagle:HY5DU121622D(L)T(P)-J: HY5DU121622D(L)T(P)-J 66pin TSOP package SD DDR1 RAM 133MHZ
U$2 = CRYSTAL (1):CRYSTAL
U$3 = sd card:SDCARDDEVICE
U$4 = USB2.0:USB2.0
U$5 U$6 = SENSOR 1:SENSOR
U$7 = DC_POWER:DC_POWER